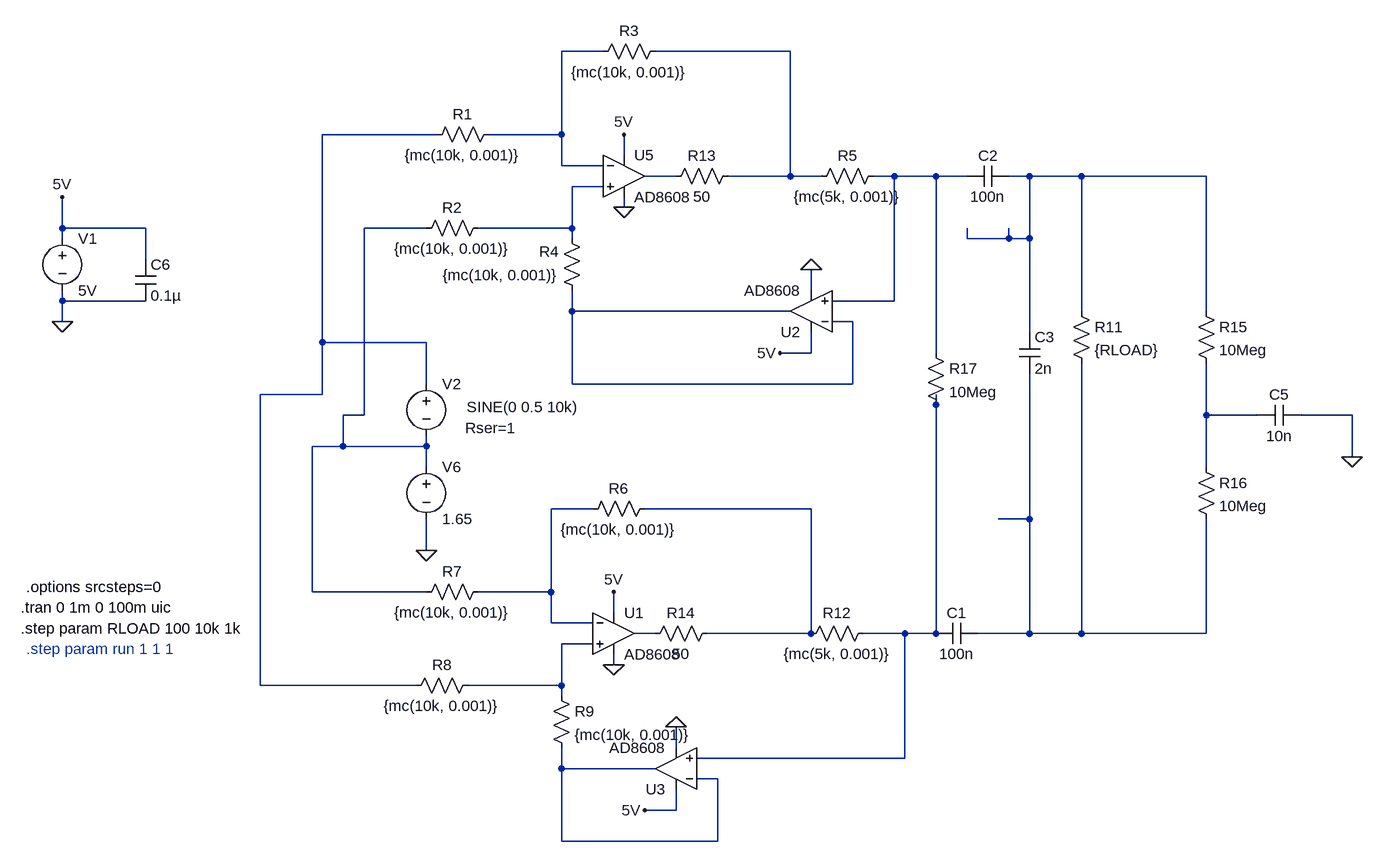
[diagram p0: schematic Mirrored EHCP - Real Opamp.asc]
Mirrored EHCP - Real Opamp.asc, the LTspice schematic file:
Version 4
SHEET 1 2740 1180
WIRE 160 -48 96 -48
WIRE 448 -48 240 -48
WIRE -96 80 -272 80
WIRE 96 80 96 -48
WIRE 96 80 -16 80
WIRE 192 112 192 80
WIRE 96 128 96 80
WIRE 160 128 96 128
WIRE 272 144 224 144
WIRE 448 144 448 -48
WIRE 448 144 352 144
WIRE 496 144 448 144
WIRE 608 144 576 144
WIRE 672 144 608 144
WIRE 720 144 672 144
WIRE 816 144 784 144
WIRE 896 144 816 144
WIRE 1088 144 896 144
WIRE 160 160 112 160
WIRE 192 192 192 176
WIRE -672 224 -672 176
WIRE -544 224 -672 224
WIRE -112 224 -208 224
WIRE 112 224 112 160
WIRE 112 224 -32 224
WIRE -672 240 -672 224
WIRE 112 240 112 224
WIRE 720 240 720 224
WIRE 784 240 784 224
WIRE 784 240 720 240
WIRE 816 240 816 144
WIRE 816 240 784 240
WIRE -544 272 -544 224
WIRE 480 320 480 288
WIRE -672 336 -672 320
WIRE -544 336 -672 336
WIRE 608 336 608 144
WIRE 608 336 512 336
WIRE 112 352 112 320
WIRE 448 352 112 352
WIRE 896 352 896 144
WIRE 1088 352 1088 144
WIRE -672 368 -672 336
WIRE 544 368 512 368
WIRE 816 384 816 240
WIRE -272 400 -272 80
WIRE -112 400 -272 400
WIRE 480 416 480 384
WIRE 480 416 432 416
WIRE 672 416 672 144
WIRE -112 464 -112 400
WIRE 112 464 112 352
WIRE 544 464 544 368
WIRE 544 464 112 464
WIRE -272 480 -272 400
WIRE -272 480 -368 480
WIRE 672 496 672 480
WIRE -208 512 -208 224
WIRE -208 512 -240 512
WIRE 1088 512 1088 432
WIRE 1168 512 1088 512
WIRE 1312 512 1232 512
WIRE -240 560 -240 512
WIRE -240 560 -288 560
WIRE -112 560 -112 544
WIRE -112 560 -240 560
WIRE 1312 576 1312 512
WIRE -112 592 -112 560
WIRE 1088 592 1088 512
WIRE 144 656 80 656
WIRE 480 656 224 656
WIRE 816 672 816 448
WIRE 816 672 768 672
WIRE -112 720 -112 672
WIRE -288 784 -288 560
WIRE -112 784 -288 784
WIRE 80 784 80 656
WIRE 80 784 -32 784
WIRE 176 816 176 784
WIRE 80 832 80 784
WIRE 144 832 80 832
WIRE 240 848 208 848
WIRE 480 848 480 656
WIRE 480 848 320 848
WIRE 624 848 560 848
WIRE 672 848 672 496
WIRE 672 848 624 848
WIRE 816 848 816 672
WIRE 816 848 736 848
WIRE 896 848 896 432
WIRE 896 848 816 848
WIRE 1088 848 1088 672
WIRE 1088 848 896 848
WIRE 144 864 96 864
WIRE 176 896 176 880
WIRE -368 928 -368 480
WIRE -128 928 -368 928
WIRE 96 928 96 864
WIRE 96 928 -48 928
WIRE 96 944 96 928
WIRE 272 1024 272 992
WIRE 624 1040 624 848
WIRE 624 1040 304 1040
WIRE 96 1056 96 1024
WIRE 240 1056 96 1056
WIRE 336 1072 304 1072
WIRE 272 1120 272 1088
WIRE 272 1120 224 1120
WIRE 96 1168 96 1056
WIRE 336 1168 336 1072
WIRE 336 1168 96 1168
FLAG 192 192 0
FLAG -672 368 0
FLAG -672 176 5V
FLAG 480 288 0
FLAG 192 80 5V
FLAG 432 416 5V
FLAG 176 896 0
FLAG 272 992 0
FLAG 176 784 5V
FLAG 224 1120 5V
FLAG -112 720 0
FLAG 1312 576 0
SYMBOL voltage -672 224 R0
WINDOW 123 0 0 Left 0
WINDOW 39 0 0 Left 0
SYMATTR InstName V1
SYMATTR Value 5V
SYMBOL cap 784 128 R90
WINDOW 0 0 32 VBottom 2
WINDOW 3 32 32 VTop 2
SYMATTR InstName C2
SYMATTR Value 100n
SYMBOL res 880 336 R0
SYMATTR InstName R11
SYMATTR Value {RLOAD}
SYMBOL cap 736 832 R90
WINDOW 0 0 32 VBottom 2
WINDOW 3 32 32 VTop 2
SYMATTR InstName C1
SYMATTR Value 100n
SYMBOL cap 800 384 R0
SYMATTR InstName C3
SYMATTR Value 2n
SYMBOL voltage -112 576 R0
WINDOW 123 0 0 Left 0
WINDOW 39 0 0 Left 0
SYMATTR InstName V6
SYMATTR Value 1.65
SYMBOL res 368 128 R90
WINDOW 0 0 56 VBottom 2
WINDOW 3 32 56 VTop 2
SYMATTR InstName R13
SYMATTR Value 50
SYMBOL res 336 832 R90
WINDOW 0 0 56 VBottom 2
WINDOW 3 32 56 VTop 2
SYMATTR InstName R14
SYMATTR Value 50
SYMBOL cap -560 272 R0
SYMATTR InstName C6
SYMATTR Value 0.1µ
SYMBOL res 656 400 R0
SYMATTR InstName R17
SYMATTR Value 10Meg
SYMBOL voltage -112 448 R0
WINDOW 3 62 51 Left 2
WINDOW 123 0 0 Left 0
WINDOW 39 60 84 Left 2
SYMATTR Value SINE(0 0.5 10k)
SYMATTR SpiceLine Rser=1
SYMATTR InstName V2
SYMBOL res 0 64 R90
WINDOW 0 0 56 VBottom 2
WINDOW 3 32 56 VTop 2
SYMATTR InstName R1
SYMATTR Value {mc(10k, 0.001)}
SYMBOL res -16 208 R90
WINDOW 0 0 56 VBottom 2
WINDOW 3 32 56 VTop 2
SYMATTR InstName R2
SYMATTR Value {mc(10k, 0.001)}
SYMBOL res 256 -64 R90
WINDOW 0 0 56 VBottom 2
WINDOW 3 32 56 VTop 2
SYMATTR InstName R3
SYMATTR Value {mc(10k, 0.001)}
SYMBOL res 128 336 R180
WINDOW 0 36 76 Left 2
WINDOW 3 36 40 Left 2
SYMATTR InstName R4
SYMATTR Value {mc(10k, 0.001)}
SYMBOL res 128 672 R270
WINDOW 0 32 56 VTop 2
WINDOW 3 0 56 VBottom 2
SYMATTR InstName R6
SYMATTR Value {mc(10k, 0.001)}
SYMBOL res -128 800 R270
WINDOW 0 32 56 VTop 2
WINDOW 3 0 56 VBottom 2
SYMATTR InstName R7
SYMATTR Value {mc(10k, 0.001)}
SYMBOL res -144 944 R270
WINDOW 0 32 56 VTop 2
WINDOW 3 0 56 VBottom 2
SYMATTR InstName R8
SYMATTR Value {mc(10k, 0.001)}
SYMBOL res 80 928 R0
SYMATTR InstName R9
SYMATTR Value {mc(10k, 0.001)}
SYMBOL res 592 128 R90
WINDOW 0 0 56 VBottom 2
WINDOW 3 32 56 VTop 2
SYMATTR InstName R5
SYMATTR Value {mc(5k, 0.001)}
SYMBOL res 576 832 R90
WINDOW 0 0 56 VBottom 2
WINDOW 3 32 56 VTop 2
SYMATTR InstName R12
SYMATTR Value {mc(5k, 0.001)}
SYMBOL cap 1232 496 R90
WINDOW 0 0 32 VBottom 2
WINDOW 3 32 32 VTop 2
SYMATTR InstName C5
SYMATTR Value 10n
SYMBOL OpAmps\\AD8608 192 80 R0
SYMATTR InstName U5
SYMBOL OpAmps\\AD8608 176 784 R0
SYMATTR InstName U1
SYMBOL OpAmps\\AD8608 480 416 R180
SYMATTR InstName U2
SYMBOL OpAmps\\AD8608 272 1120 R180
SYMATTR InstName U3
SYMBOL res 1072 336 R0
SYMATTR InstName R15
SYMATTR Value 10Meg
SYMBOL res 1072 576 R0
SYMATTR InstName R16
SYMATTR Value 10Meg
TEXT -736 808 Left 2 !.tran 0 1m 0 100m uic
TEXT -728 776 Left 2 !.options srcsteps=0
TEXT -736 840 Left 2 !.step param RLOAD 100 10k 1k
TEXT -728 872 Left 2 ;.step param run 1 1 1

The netlist it stands for:
* Mirrored EHCP - Real Opamp.asc
V1 5V 0 5V
C2 N006 N005 100n
R11 N006 N014 {RLOAD}
C1 N014 N010 100n
C3 N006 N014 2n
V6 N008 0 1.65
R13 N002 N004 50
R14 N013 N015 50
C6 5V 0 0.1µ
R17 N005 N010 10Meg
V2 N003 N008 SINE(0 0.5 10k) Rser=1
R1 N001 N003 {mc(10k, 0.001)}
R2 N007 N008 {mc(10k, 0.001)}
R3 N002 N001 {mc(10k, 0.001)}
R4 N009 N007 {mc(10k, 0.001)}
R6 N012 N013 {mc(10k, 0.001)}
R7 N008 N012 {mc(10k, 0.001)}
R8 N003 N016 {mc(10k, 0.001)}
R9 N016 N017 {mc(10k, 0.001)}
R5 N005 N002 {mc(5k, 0.001)}
R12 N010 N013 {mc(5k, 0.001)}
C5 0 N011 10n
XU5 N007 N001 5V 0 N004 AD8608  ; pins In+ In- V+ V- OUT
XU1 N016 N012 5V 0 N015 AD8608  ; pins In+ In- V+ V- OUT
XU2 N005 N009 5V 0 N009 AD8608  ; pins In+ In- V+ V- OUT
XU3 N010 N017 5V 0 N017 AD8608  ; pins In+ In- V+ V- OUT
R15 N006 N011 10Meg
R16 N011 N014 10Meg
.tran 0 1m 0 100m uic
.options srcsteps=0
.step param RLOAD 100 10k 1k
* .step param run 1 1 1
.backanno
.end